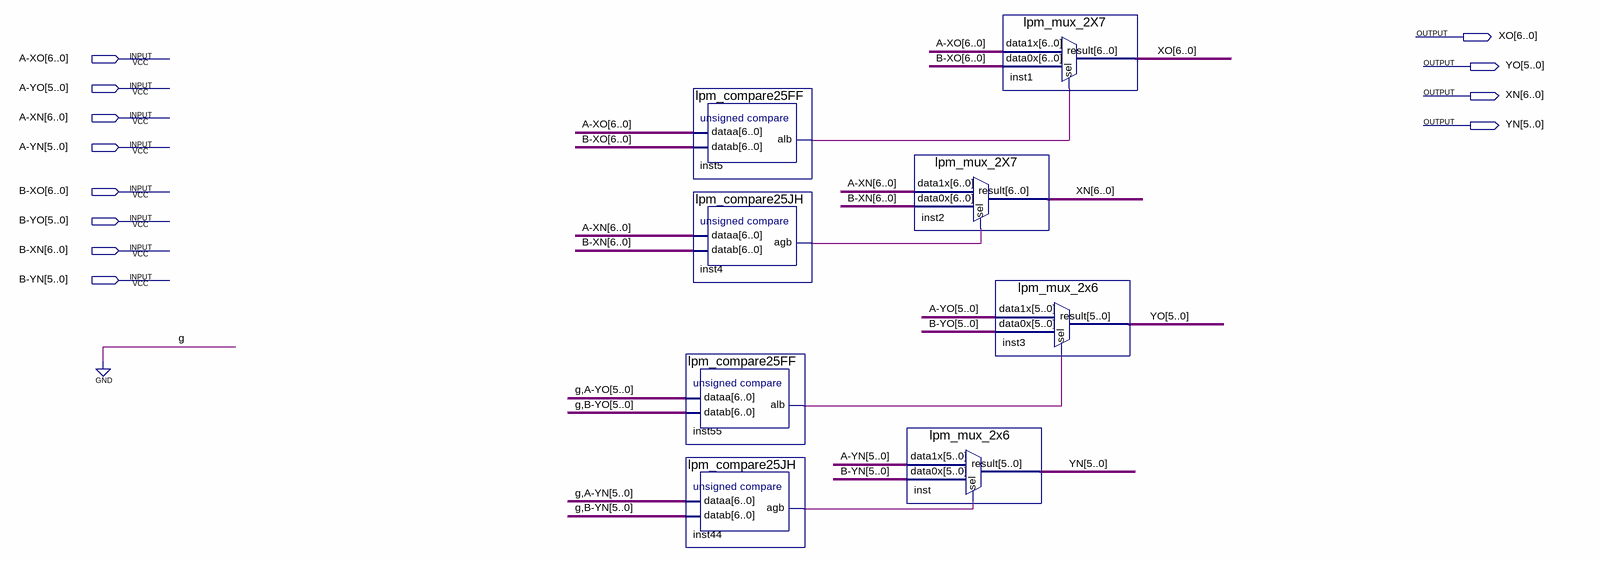
[diagram p0: schematic sheet]
// Quartus schematic expansion_all.bdf as structural Verilog: 8 symbols, 12 pins
module expansion_all (
  input  [6:0] \A-XO ,
  input  [5:0] \A-YO ,
  input  [6:0] \A-XN ,
  input  [5:0] \A-YN ,
  input  [6:0] \B-XO ,
  input  [5:0] \B-YO ,
  input  [6:0] \B-XN ,
  input  [5:0] \B-YN ,
  output [6:0] XO,
  output [5:0] YO,
  output [6:0] XN,
  output [5:0] YN
);

  wire inst4_agb, inst5_alb, inst44_agb, inst55_alb;

  lpm_compare25FF inst5 (.dataa(\A-XO ), .datab(\B-XO ), .alb(inst5_alb));
  lpm_compare25JH inst4 (.dataa(\A-XN ), .datab(\B-XN ), .agb(inst4_agb));
  lpm_compare25FF inst55 (.dataa({1'b0, \A-YO }), .datab({1'b0, \B-YO }), .alb(inst55_alb));
  lpm_compare25JH inst44 (.dataa({1'b0, \A-YN }), .datab({1'b0, \B-YN }), .agb(inst44_agb));
  lpm_mux_2x6 inst (.data1x(\A-YN ), .data0x(\B-YN ), .sel(inst44_agb), .result(YN));
  lpm_mux_2X7 inst2 (.data1x(\A-XN ), .data0x(\B-XN ), .sel(inst4_agb), .result(XN));
  lpm_mux_2X7 inst1 (.data1x(\A-XO ), .data0x(\B-XO ), .sel(inst5_alb), .result(XO));
  lpm_mux_2x6 inst3 (.data1x(\A-YO ), .data0x(\B-YO ), .sel(inst55_alb), .result(YO));
endmodule
